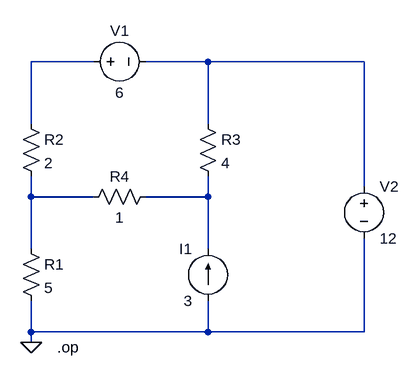
[diagram p0: schematic CH03-KP1-11.asc]
CH03-KP1-11.asc, the LTspice schematic file:
Version 4
SHEET 1 880 680
WIRE 16 144 -80 144
WIRE 192 144 96 144
WIRE 432 144 192 144
WIRE -80 240 -80 144
WIRE 192 240 192 144
WIRE 432 336 432 144
WIRE -80 352 -80 320
WIRE 16 352 -80 352
WIRE 192 352 192 320
WIRE 192 352 96 352
WIRE -80 432 -80 352
WIRE 192 432 192 352
WIRE -80 560 -80 512
WIRE 192 560 192 512
WIRE 192 560 -80 560
WIRE 432 560 432 416
WIRE 432 560 192 560
WIRE -80 576 -80 560
FLAG -80 576 0
SYMBOL res -96 416 R0
SYMATTR InstName R1
SYMATTR Value 5
SYMBOL res -96 224 R0
SYMATTR InstName R2
SYMATTR Value 2
SYMBOL res 176 224 R0
SYMATTR InstName R3
SYMATTR Value 4
SYMBOL res 0 368 R270
WINDOW 0 32 56 VTop 2
WINDOW 3 0 56 VBottom 2
SYMATTR InstName R4
SYMATTR Value 1
SYMBOL voltage 0 144 R270
WINDOW 0 32 56 VTop 2
WINDOW 3 -32 56 VBottom 2
SYMATTR InstName V1
SYMATTR Value 6
SYMBOL voltage 432 320 R0
SYMATTR InstName V2
SYMATTR Value 12
SYMBOL current 192 512 R180
WINDOW 0 24 80 Left 2
WINDOW 3 24 0 Left 2
SYMATTR InstName I1
SYMATTR Value 3
TEXT -40 584 Left 2 !.op

The netlist it stands for:
* CH03-KP1-11.asc
R1 N003 0 5
R2 N001 N003 2
R3 N002 N004 4
R4 N003 N004 1
V1 N001 N002 6
V2 N002 0 12
I1 0 N004 3
.op
.backanno
.end